# Altium schematic sheet Test_Points.SchDoc: Test Points
size A4; DocumentNumber: 16; SheetNumber: 16; SheetTotal: 31
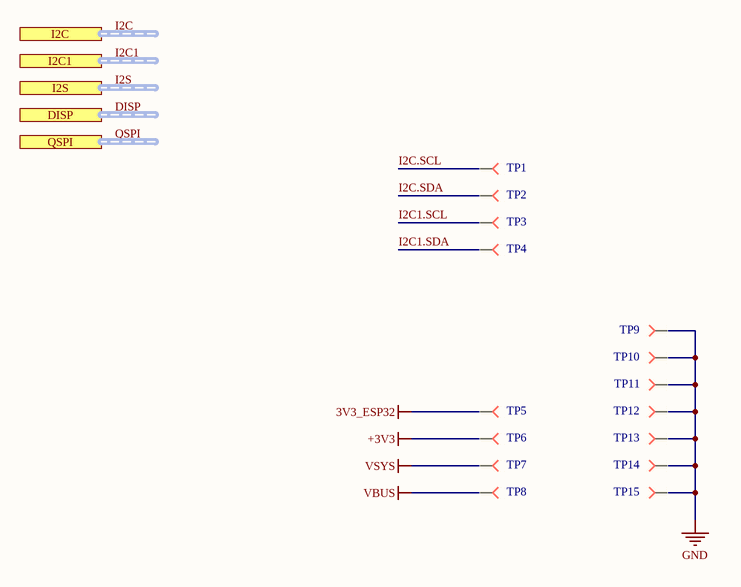
[diagram p0: Test_Points.SchDoc]

## Parts
TP1  Test Point Pad  [Testpoint]  (value not drawn)  (no BOM)
TP2  Test Point Pad  [Testpoint]  (value not drawn)  (no BOM)
TP3  Test Point Pad  [Testpoint]  (value not drawn)  (no BOM)
TP4  Test Point Pad  [Testpoint]  (value not drawn)  (no BOM)
TP5  Test Point Pad  [Testpoint]  (value not drawn)  (no BOM)
TP6  Test Point Pad  [Testpoint]  (value not drawn)  (no BOM)
TP7  Test Point Pad  [Testpoint]  (value not drawn)  (no BOM)
TP8  Test Point Pad  [Testpoint]  (value not drawn)  (no BOM)
TP9  Test Point Pad  [Testpoint]  (value not drawn)  (no BOM)
TP10  Test Point Pad  [Testpoint]  (value not drawn)  (no BOM)
TP11  Test Point Pad  [Testpoint]  (value not drawn)  (no BOM)
TP12  Test Point Pad  [Testpoint]  (value not drawn)  (no BOM)
TP13  Test Point Pad  [Testpoint]  (value not drawn)  (no BOM)
TP14  Test Point Pad  [Testpoint]  (value not drawn)  (no BOM)
TP15  Test Point Pad  [Testpoint]  (value not drawn)  (no BOM)

## Ports
DISP (harness DISP_SPI), I2C1 (harness I2C), I2C (harness I2C), I2S (harness I2S), QSPI (harness QSPI)

## Nets
3V3_ESP32: TP5.1
+3V3: TP6.1
GND: TP9.1 TP10.1 TP11.1 TP12.1 TP13.1 TP14.1 TP15.1
VBUS: TP8.1
VSYS: TP7.1
I2C1.SCL: TP3.1
I2C1.SDA: TP4.1
I2C.SCL: TP1.1
I2C.SDA: TP2.1

## Buses and harness runs
harness DISP = port DISP
harness I2C1 = port I2C1
harness I2C = port I2C
harness I2S = port I2S
harness QSPI = port QSPI

## Notes on the sheet
- Title
- Size:
- Date:
- A4
- Number:
- Time:
- Revision:
- Sheet
- of
- File:

## Library data of the parts
TP1-TP15 = Test Point Pad: Test Point. There is nothing to buy or mount.; ClassName: TestPoint; CompType: TestPoint; Manufacturer: N/A; MountType: N/A; PackageReference: TetsPoint; PartNumber: N/A